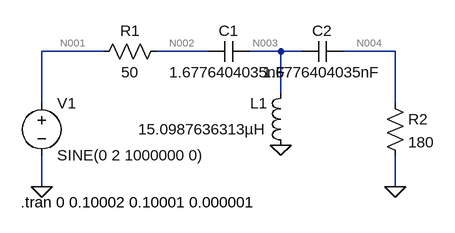
[diagram p0: schematic Circuit Theory Lab-4.asc]
Circuit Theory Lab-4.asc, the LTspice schematic file:
Version 4
SHEET 1 912 680
WIRE 0 80 -96 80
WIRE 160 80 80 80
WIRE 272 80 224 80
WIRE 304 80 272 80
WIRE 448 80 368 80
WIRE 272 144 272 80
WIRE -96 160 -96 80
WIRE 448 160 448 80
WIRE -96 288 -96 240
WIRE 448 288 448 240
FLAG -96 288 0
FLAG 448 288 0
FLAG 272 224 0
SYMBOL voltage -96 144 R0
WINDOW 123 0 0 Left 0
WINDOW 39 0 0 Left 0
SYMATTR InstName V1
SYMATTR Value SINE(0 2 1000000 0)
SYMBOL res 96 64 R90
WINDOW 0 0 56 VBottom 2
WINDOW 3 32 56 VTop 2
SYMATTR InstName R1
SYMATTR Value 50
SYMBOL res 432 144 R0
SYMATTR InstName R2
SYMATTR Value 180
SYMBOL cap 160 96 R270
WINDOW 0 32 32 VTop 2
WINDOW 3 0 32 VBottom 2
SYMATTR InstName C1
SYMATTR Value 1.6776404035nF
SYMBOL ind 288 240 R180
WINDOW 0 36 80 Left 2
WINDOW 3 36 40 Left 2
SYMATTR InstName L1
SYMATTR Value 15.0987636313µH
SYMBOL cap 304 96 R270
WINDOW 0 32 32 VTop 2
WINDOW 3 0 32 VBottom 2
SYMATTR InstName C2
SYMATTR Value 1.6776404035nF
TEXT -128 312 Left 2 !.tran 0 0.10002 0.10001 0.000001

The netlist it stands for:
* Circuit Theory Lab-4.asc
V1 N001 0 SINE(0 2 1000000 0)
R1 N002 N001 50
R2 N004 0 180
C1 N002 N003 1.6776404035nF
L1 0 N003 15.0987636313µH
C2 N003 N004 1.6776404035nF
.tran 0 0.10002 0.10001 0.000001
.backanno
.end

* Results of the author's LTspice run, read from the files saved beside the schematic
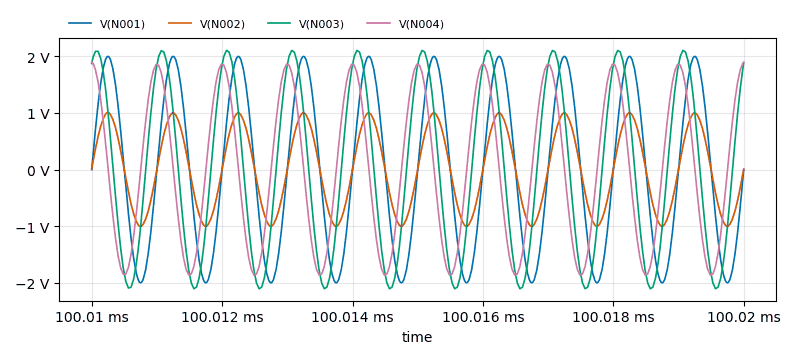
[diagram p1: Transient Analysis of Circuit Theory Lab-4.asc, plotted from the saved traces]
* Transient Analysis, 1 run:
*   V(N001): min -2 V, max 2 V, average 1.675 µV, rms 1.416 V, last 0 V
*   V(N002): min -1.004 V, max 1.008 V, average 209.8 µV, rms 704 mV, last 5.908 mV
*   V(N003): min -2.105 V, max 2.106 V, average 452.2 µV, rms 1.493 V, last 1.887 V
*   V(N004): min -1.861 V, max 1.9 V, average 660.1 µV, rms 1.32 V, last 1.897 V